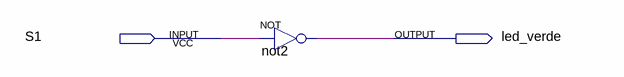
[diagram p0: schematic sheet]
// Quartus schematic saida_verde.bdf as structural Verilog: 1 symbols, 2 pins
module saida_verde (
  input  S1,
  output led_verde
);

  not not2 (led_verde, S1);
endmodule
